# Altium schematic sheet CH382SSP.SchDoc
size A4; SheetNumber: 0; SheetTotal: 0
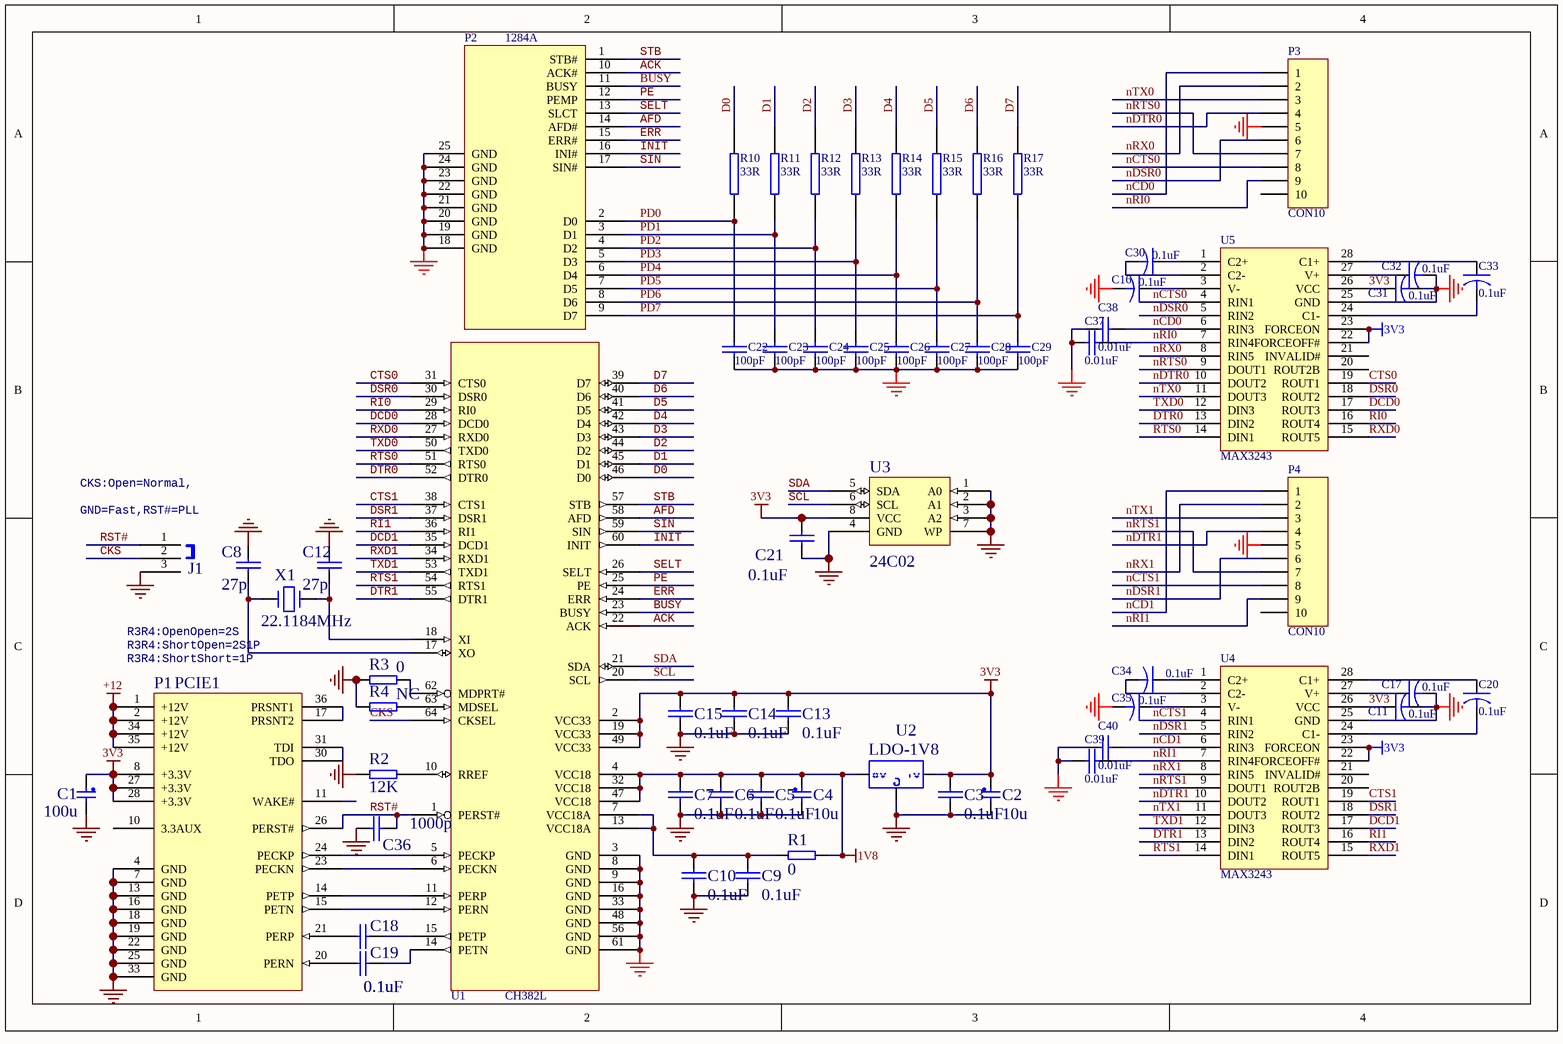
[diagram p0: CH382SSP.SchDoc]

## Parts
C1  100u  [CD0.1]
C2  10u  [3216]
C3  0.1uF  [0603]
C4  10u  [3216]
C5  0.1uF  [0603]
C6  0.1uF  [0603]
C7  0.1uF  [0603]
C8  27p  [0603]
C9  0.1uF  [0603]
C10  0.1uF  [0603]
C11  0.1uF  [0603]
C12  27p  [0603]
C13  0.1uF  [0603]
C14  0.1uF  [0603]
C15  0.1uF  [0603]
C16  0.1uF  [0603]
C17  0.1uF  [0603]
C18  0.1uF  [0603]
C19  0.1uF  [0603]
C20  0.1uF  [0603]
C21  0.1uF  [0603]
C22  100pF  [0603]
C23  100pF  [0603]
C24  100pF  [0603]
C25  100pF  [0603]
C26  100pF  [0603]
C27  100pF  [0603]
C28  100pF  [0603]
C29  100pF  [0603]
C30  0.1uF  [0603]
C31  0.1uF  [0603]
C32  0.1uF  [0603]
C33  0.1uF  [0603]
C34  0.1uF  [0603]
C35  0.1uF  [0603]
C36  1000p  [0603]
C37  0.01uF  [0603]
C38  0.01uF  [0603]
C39  0.01uF  [0603]
C40  0.01uF  [0603]
J1  3JUMPS  [SIP3]  (value not drawn)
P1  PCIE1  [PCIE1]
P2  1284A  [DB25RA/F]
P3  CON10  [IDC10]
P4  CON10  [IDC10]
R1  0  [0805]
R2  12K  [0603]
R3  0  [0603]
R4  NC  [0603]
R10  33R  [0603]
R11  33R  [0603]
R12  33R  [0603]
R13  33R  [0603]
R14  33R  [0603]
R15  33R  [0603]
R16  33R  [0603]
R17  33R  [0603]
U1  CH382L  [LQFP64]
U2  LDO-1V8  [SOT-223]
U3  24C02  [SOP8]
U4  MAX3243  [SSOP28]
U5  MAX3243  [SSOP28]
X1  22.1184MHz  [XTAL62/28]

## Nets
1V8: C4.1 C5.1 C6.1 C7.1 R1.1 U1.4(VCC18) U1.32(VCC18) U1.47(VCC18) U2.2
3V3: C1.1 C2.1 C3.1 C11.1 C13.1 C14.1 C15.1 C21.1 C31.1 P1.8(+3.3V) P1.27(+3.3V) P1.28(+3.3V) U1.2(VCC33) U1.19(VCC33) U1.49(VCC33) U2.3 U3.8(VCC) U4.22(FORCEOFF#) U4.23(FORCEON) U4.26(VCC) U5.22(FORCEOFF#) U5.23(FORCEON) U5.26(VCC)
+12: P1.1(+12V) P1.2(+12V) P1.34(+12V) P1.35(+12V)
GND: C1.2 C2.2 C3.2 C4.2 C5.2 C6.2 C7.2 C8.2 C9.2 C10.2 C11.2 C12.2 C13.2 C14.2 C15.2 C16.2 C17.2 C21.2 C22.2 C23.2 C24.2 C25.2 C26.2 C27.2 C28.2 C29.2 C31.2 C32.2 C35.2 C36.2 C37.1 C38.1 C39.1 C40.1 J1.3 P1.4(GND) P1.7(GND) P1.13(GND) P1.16(GND) P1.18(GND) P1.19(GND) P1.22(GND) P1.25(GND) P1.33(GND) P2.18(GND) P2.19(GND) P2.20(GND) P2.21(GND) P2.22(GND) P2.23(GND) P2.24(GND) P2.25(GND) P3.5 P4.5 R2.1 R3.2 R4.2 U1.3(GND) U1.8(GND) U1.9(GND) U1.16(GND) U1.33(GND) U1.48(GND) U1.56(GND) U1.61(GND) U2.1 U3.1(A0) U3.2(A1) U3.3(A2) U3.4(GND) U3.7(WP) U4.25(GND) U5.25(GND)
ACK: P2.10(ACK#) U1.22(ACK)
AFD: P2.14(AFD#) U1.58(AFD)
BUSY: P2.11(BUSY) U1.23(BUSY)
CKS: J1.2 U1.64(CKSEL)
CTS0: U1.31(CTS0) U5.19(ROUT1)
CTS1: U1.38(CTS1) U4.19(ROUT1)
D0: R10.2 U1.46(D0)
D1: R11.2 U1.45(D1)
D2: R12.2 U1.44(D2)
D3: R13.2 U1.43(D3)
D4: R14.2 U1.42(D4)
D5: R15.2 U1.41(D5)
D6: R16.2 U1.40(D6)
D7: R17.2 U1.39(D7)
DCD0: U1.28(DCD0) U5.17(ROUT3)
DCD1: U1.35(DCD1) U4.17(ROUT3)
DSR0: U1.30(DSR0) U5.18(ROUT2)
DSR1: U1.37(DSR1) U4.18(ROUT2)
DTR0: U1.52(DTR0) U5.13(DIN2)
DTR1: U1.55(DTR1) U4.13(DIN2)
ERR: P2.15(ERR#) U1.24(ERR)
INIT: P2.16(INI#) U1.60(INIT)
nCD0: C38.2 P3.1 U5.6(RIN3)
nCD1: C40.2 P4.1 U4.6(RIN3)
nCTS0: P3.8 U5.4(RIN1)
nCTS1: P4.8 U4.4(RIN1)
nDSR0: P3.6 U5.5(RIN2)
nDSR1: P4.6 U4.5(RIN2)
nDTR0: P3.4 U5.10(DOUT2)
nDTR1: P4.4 U4.10(DOUT2)
nRI0: C37.2 P3.9 U5.7(RIN4)
nRI1: C39.2 P4.9 U4.7(RIN4)
nRTS0: P3.7 U5.9(DOUT1)
nRTS1: P4.7 U4.9(DOUT1)
nRX0: P3.2 U5.8(RIN5)
nRX1: P4.2 U4.8(RIN5)
nTX0: P3.3 U5.11(DOUT3)
nTX1: P4.3 U4.11(DOUT3)
PD0: C22.1 P2.2(D0) R10.1
PD1: C23.1 P2.3(D1) R11.1
PD2: C24.1 P2.4(D2) R12.1
PD3: C25.1 P2.5(D3) R13.1
PD4: C26.1 P2.6(D4) R14.1
PD5: C27.1 P2.7(D5) R15.1
PD6: C28.1 P2.8(D6) R16.1
PD7: C29.1 P2.9(D7) R17.1
PE: P2.12(PEMP) U1.25(PE)
RI0: U1.29(RI0) U5.16(ROUT4)
RI1: U1.36(RI1) U4.16(ROUT4)
RST#: C36.1 J1.1 P1.26(PERST#) U1.1(PERST#)
RTS0: U1.51(RTS0) U5.14(DIN1)
RTS1: U1.54(RTS1) U4.14(DIN1)
RXD0: U1.27(RXD0) U5.15(ROUT5)
RXD1: U1.34(RXD1) U4.15(ROUT5)
SCL: U1.20(SCL) U3.6(SCL)
SDA: U1.21(SDA) U3.5(SDA)
SELT: P2.13(SLCT) U1.26(SELT)
SIN: P2.17(SIN#) U1.59(SIN)
STB: P2.1(STB#) U1.57(STB)
TXD0: U1.50(TXD0) U5.12(DIN3)
TXD1: U1.53(TXD1) U4.12(DIN3)
NetC8_1: C8.1 U1.17(XO) X1.2
NetC9_1: C9.1 C10.1 R1.2 U1.7(VCC18A) U1.13(VCC18A)
NetC12_1: C12.1 U1.18(XI) X1.1
NetC16_1: C16.1 U5.3(V-)
NetC17_1: C17.1 U4.27(V+)
NetC18_1: C18.1 P1.21(PERP)
NetC18_2: C18.2 U1.15(PETP)
NetC19_1: C19.1 P1.20(PERN)
NetC19_2: C19.2 U1.14(PETN)
NetC20_1: C20.1 U4.28(C1+)
NetC20_2: C20.2 U4.24(C1-)
NetC30_1: C30.1 U5.1(C2+)
NetC30_2: C30.2 U5.2(C2-)
NetC32_1: C32.1 U5.27(V+)
NetC33_1: C33.1 U5.28(C1+)
NetC33_2: C33.2 U5.24(C1-)
NetC34_1: C34.1 U4.1(C2+)
NetC34_2: C34.2 U4.2(C2-)
NetC35_1: C35.1 U4.3(V-)
NetP1_14: P1.14(PETP) U1.11(PERP)
NetP1_15: P1.15(PETN) U1.12(PERN)
NetP1_17: P1.17(PRSNT2) P1.36(PRSNT1)
NetP1_23: P1.23(PECKN) U1.6(PECKN)
NetP1_24: P1.24(PECKP) U1.5(PECKP)
NetP1_30: P1.30(TDO) P1.31(TDI)
NetR2_2: R2.2 U1.10(RREF)
NetR3_1: R3.1 U1.62(MDPRT#)
NetR4_1: R4.1 U1.63(MDSEL)

Not connected (* = marked no-connect by the designer): P1 10(3.3AUX) 11(WAKE#); P3 10; P4 10; U4 20(ROUT2B) 21(INVALID#); U5 20(ROUT2B) 21(INVALID#)

## Notes on the sheet
- (near J1) GND=Fast,RST#=PLL
- CKS:Open=Normal,
- R3R4:ShortOpen=2S1P
- R3R4:OpenOpen=2S
- (near P1) R3R4:ShortShort=1P

## Library data of the parts
C1 = Pro89C.tmp_100u_10
C2 C4 = Pro89C.tmp_10u_4
C3 C5-C7 C9 C10 C13-C15 C21 = Pro89C.tmp_0.1u_3
C8 C12 C36 = Pro5B1.tmp_27p_3
C11 C16 C17 C20 C30-C35 = CAPACITOR
C18 = Pro89C.tmp_0.1u_70
C19 = Pro89C.tmp_0.1u_71
C22-C29 C37-C40 = CAP: Capacitor
J1 = Pro5B1.tmp_3JUMPS_1
P1 = Pro89C.tmp_PCIE1_69
P3 P4 = CON10: Connector
R1 = Pro89C.tmp_0_1
R2 = Pro5B1.tmp_12K_15
R3 R4 = Pro3F8.tmp_0_4
R10-R17 = RES2
U1 = CH382L: PCIe to 2S1P: Print Port / Parallel and Dual 16C550 UART with 256 byte FIFO
U2 = Pro89C.tmp_LDO-1V8_68
U3 = Pro89C.tmp_24C02_11
X1 = Pro5B1.tmp_22.1184MHz_4